# Altium schematic sheet BMS1.SchDoc
size A0
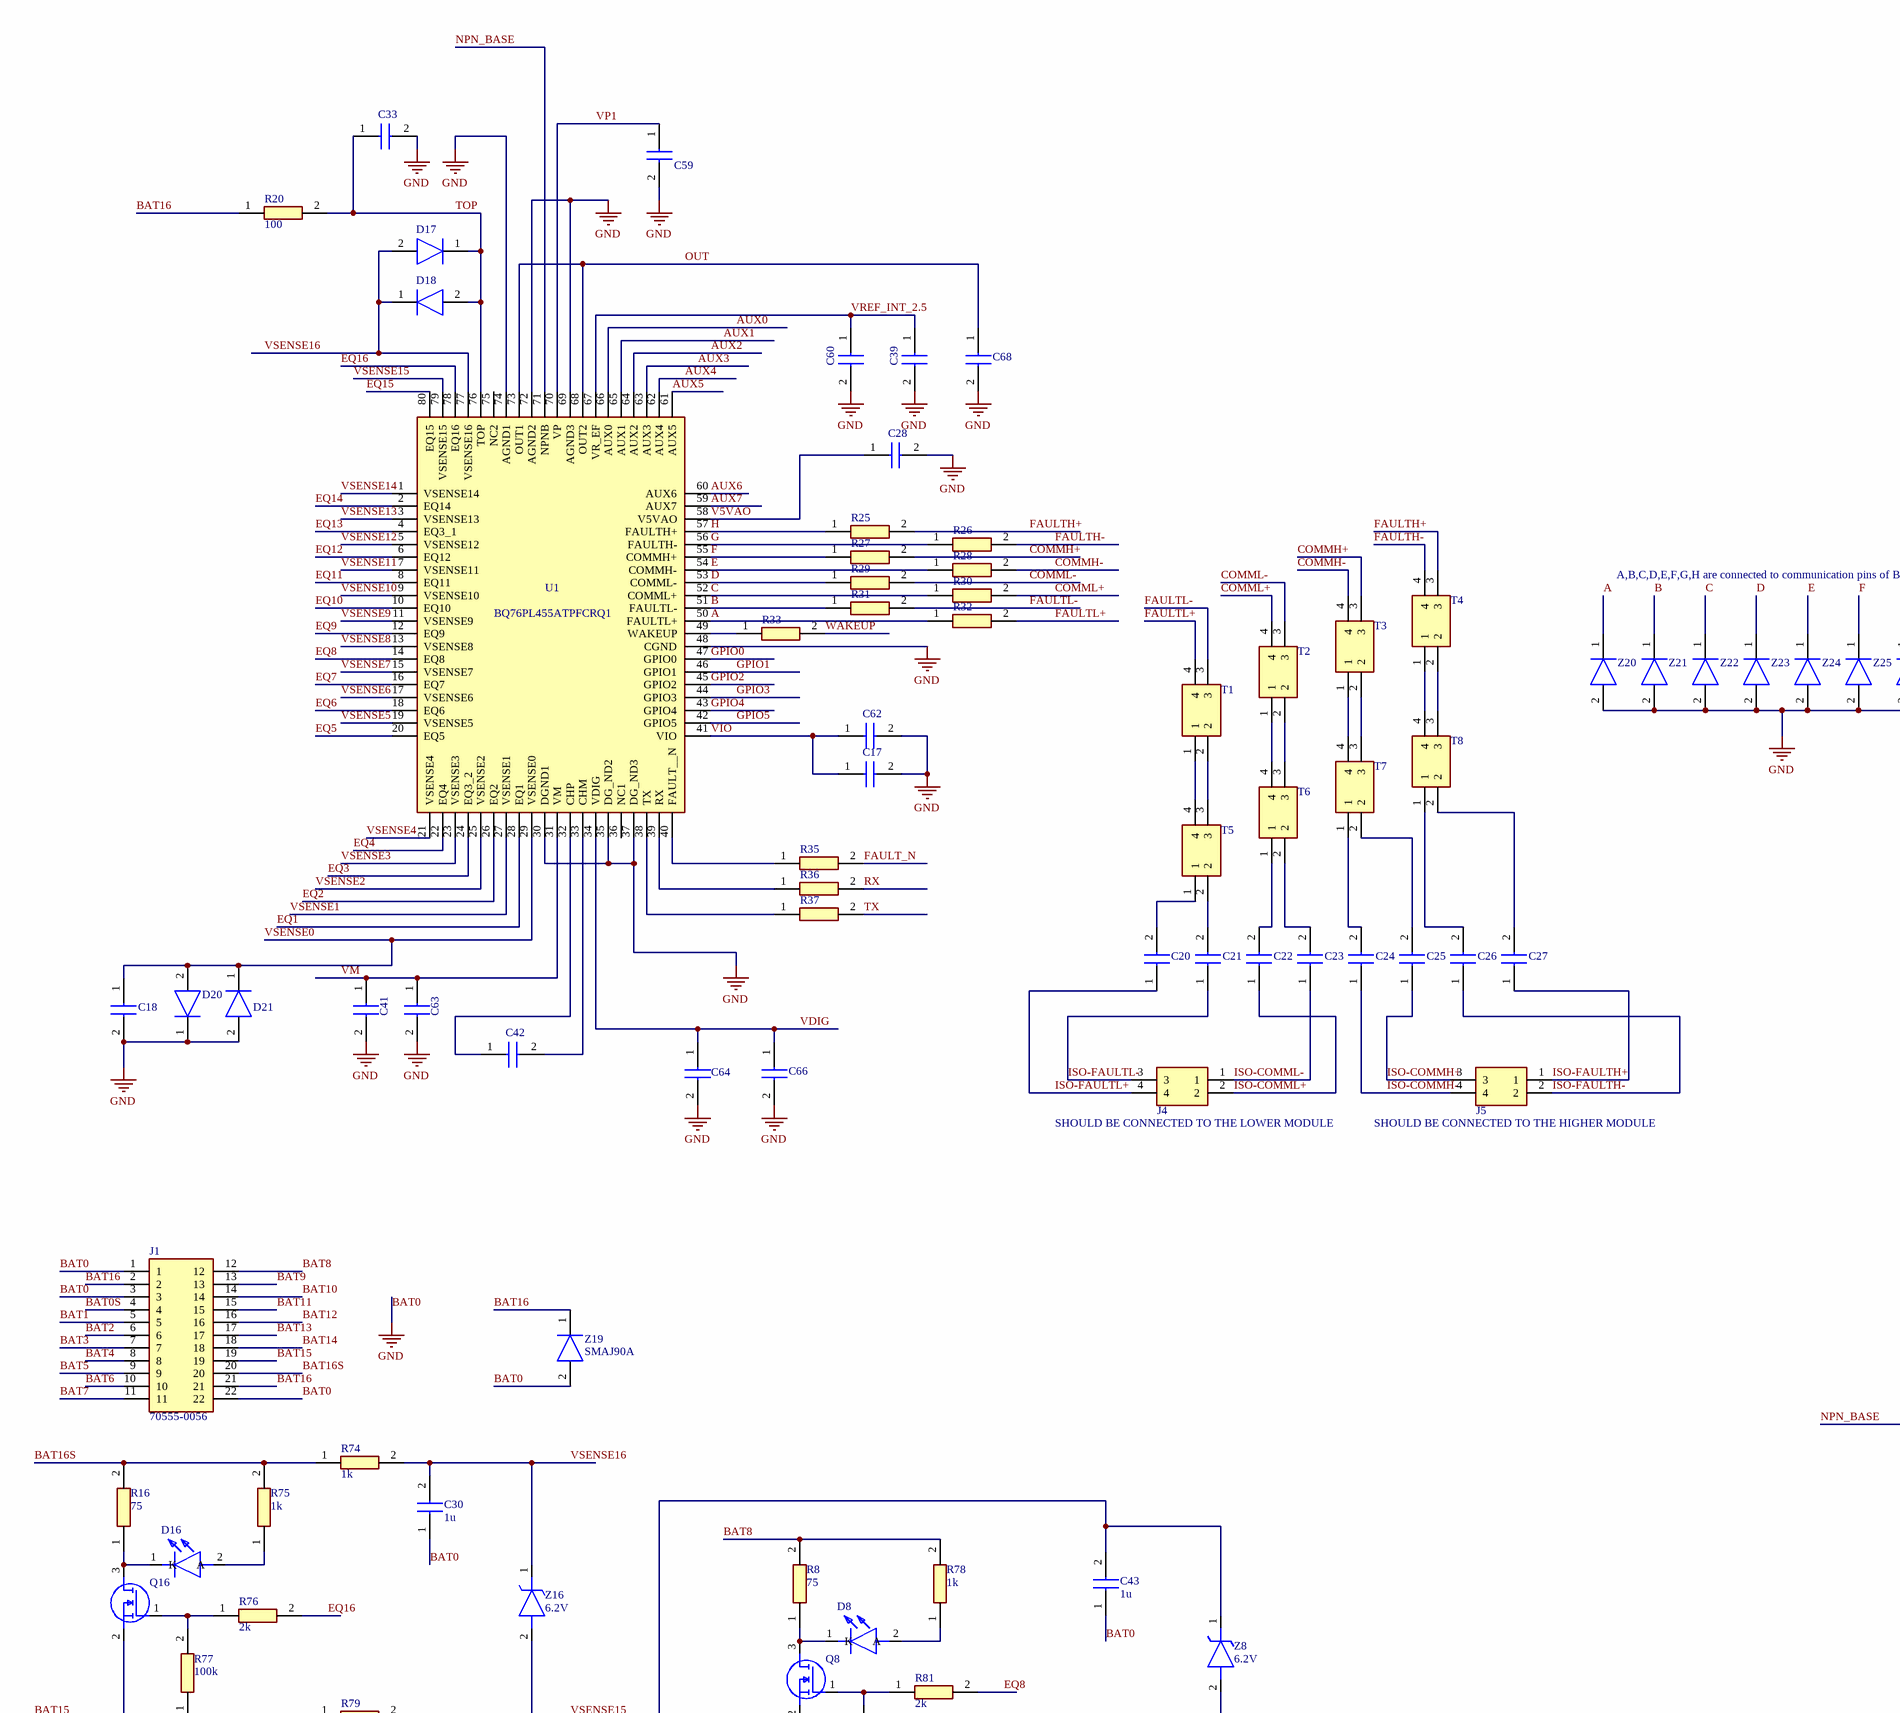
[diagram p0: BMS1.SchDoc, top left]
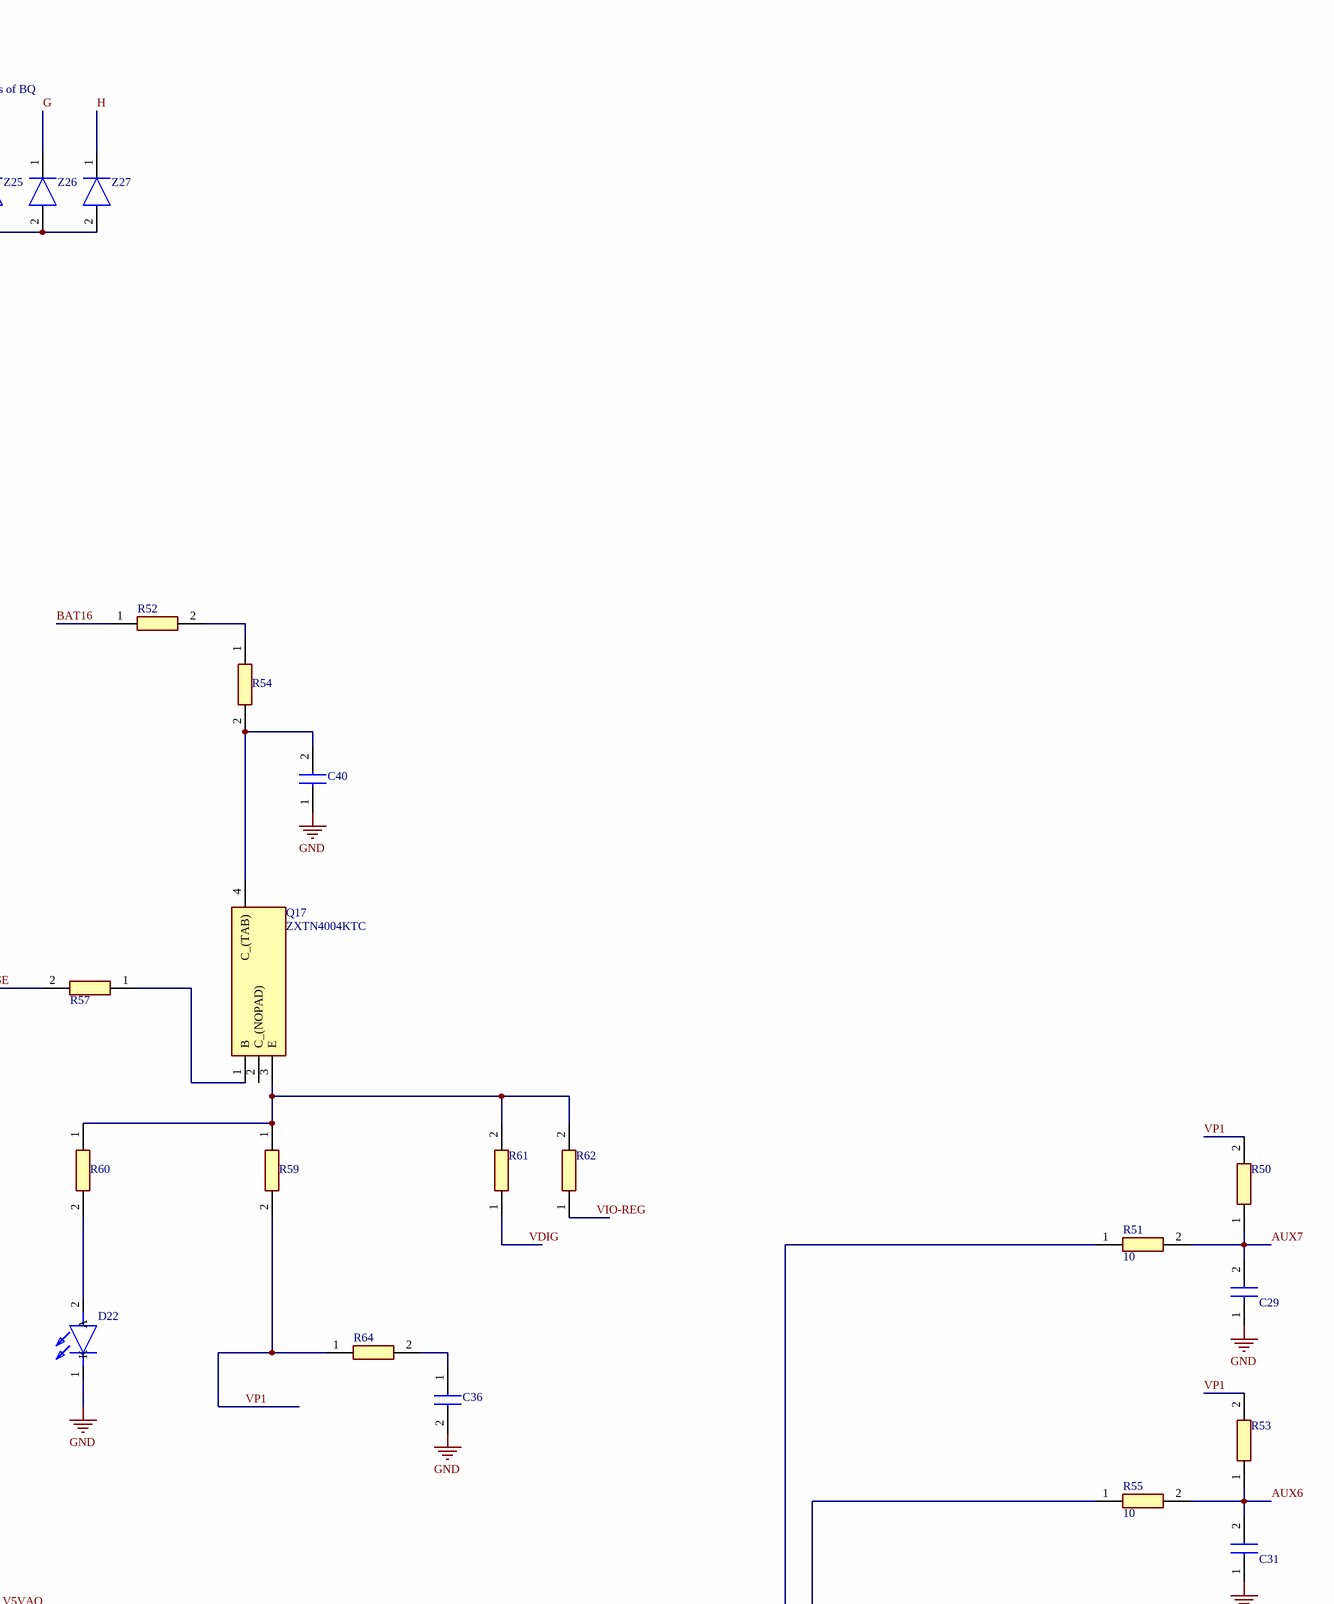
[diagram p1: BMS1.SchDoc, top right]
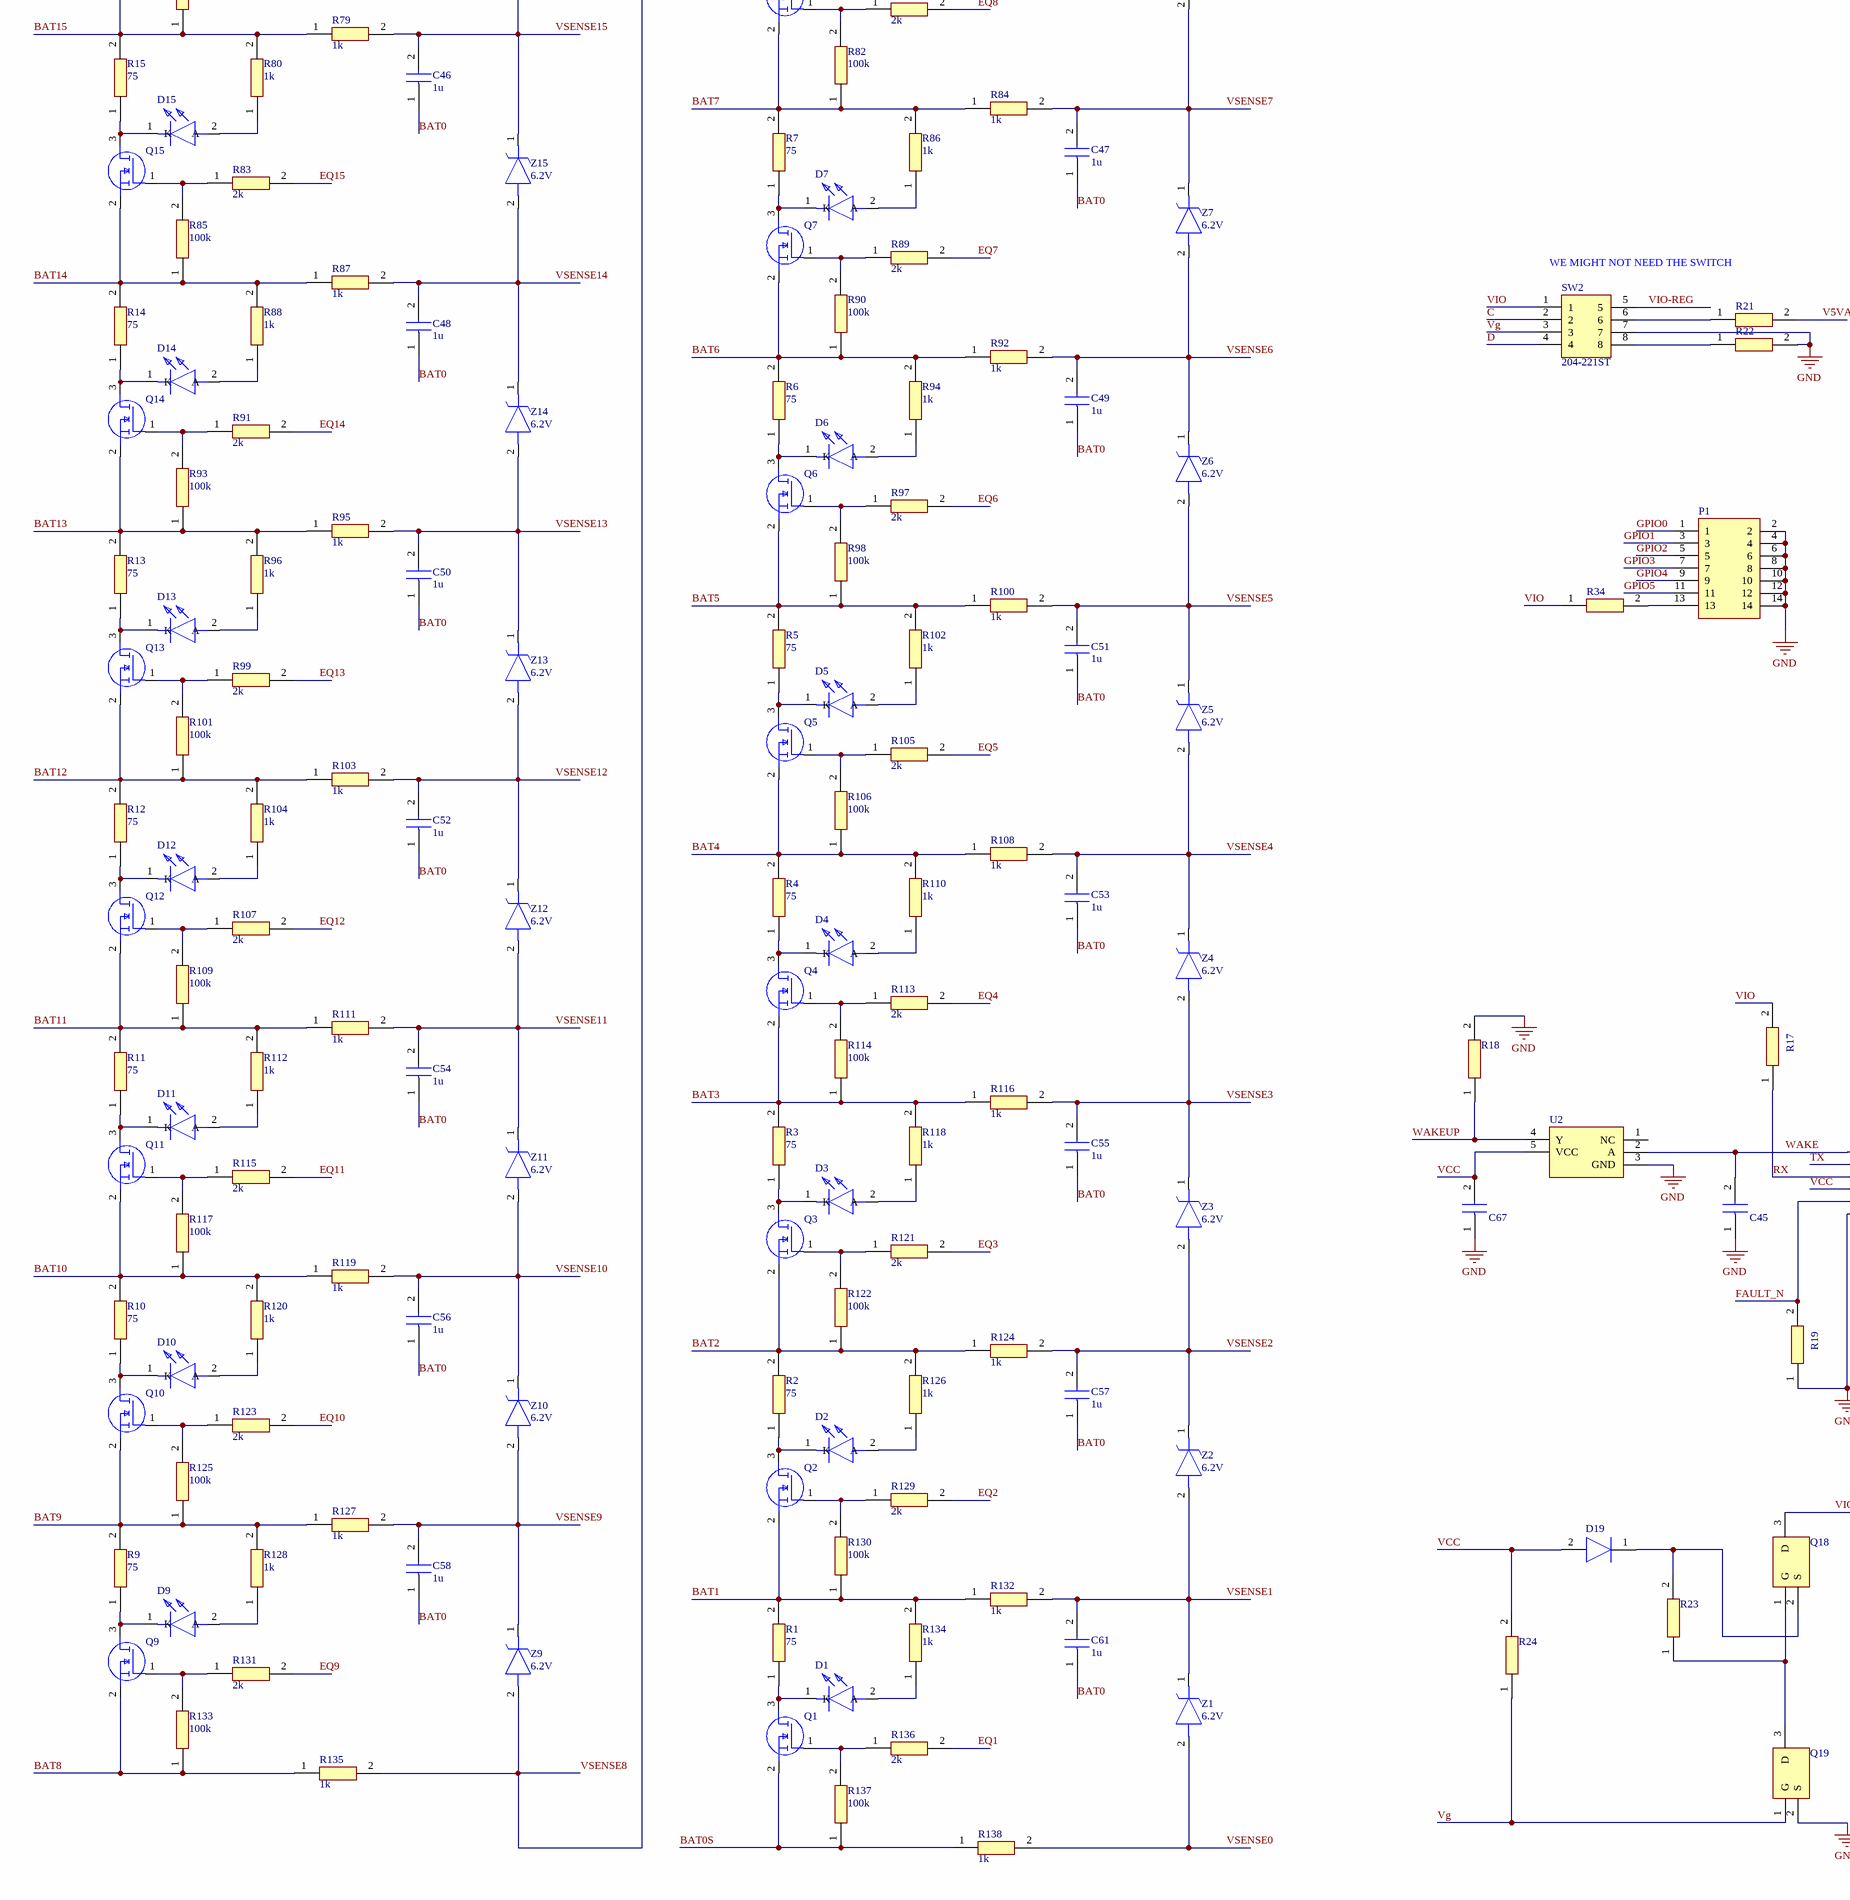
[diagram p2: BMS1.SchDoc, bottom left]
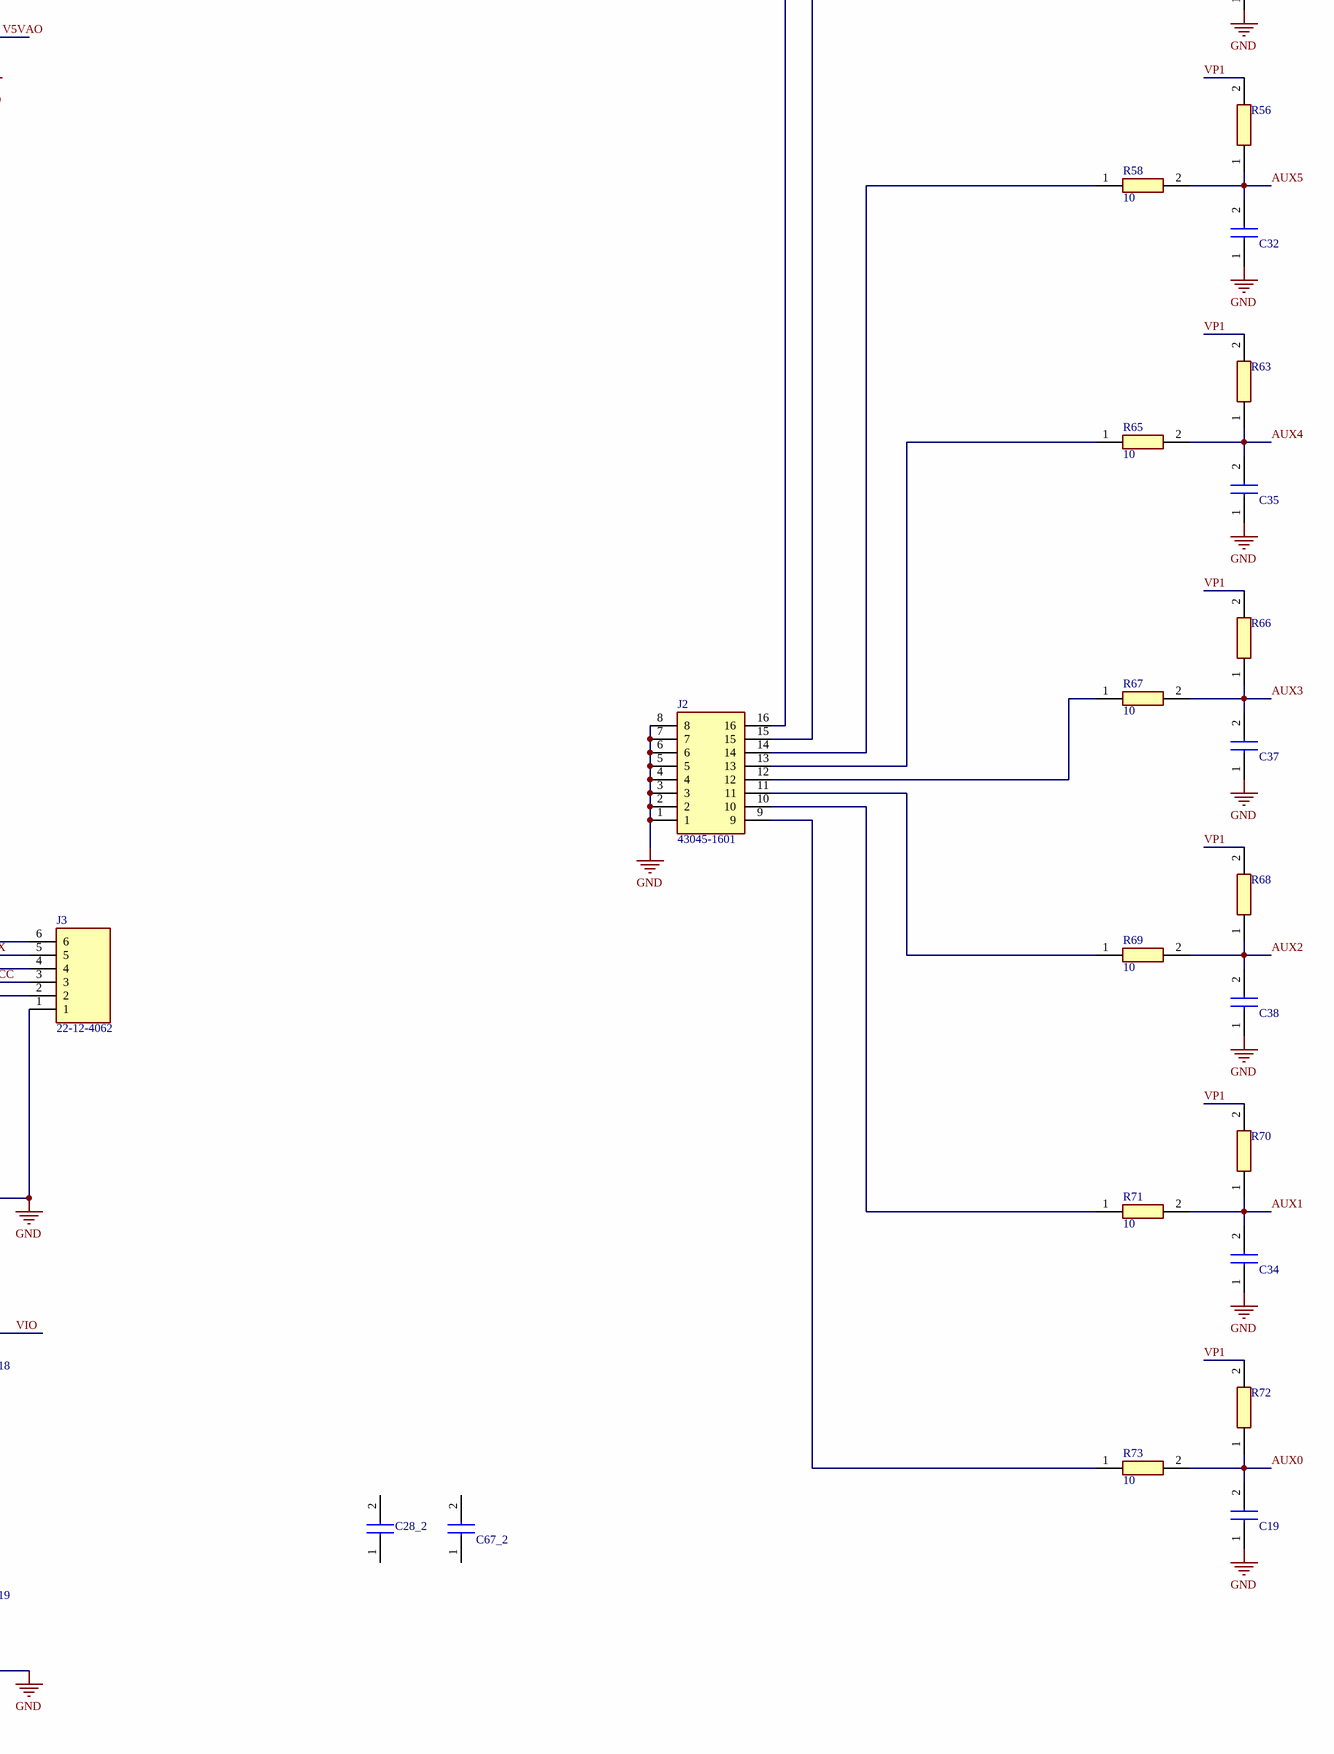
[diagram p3: BMS1.SchDoc, bottom right]

## Parts
C17  1u  [CAPC1608X80N]  (value not drawn)
C18  1u  [CAPC1608X80N]  (value not drawn)
C19  C1608X7R1H104K080AA  [CAPC1608X80N]  (value not drawn)
C20  CC1206KKX7RCBB102  [CAPC3216X70N]  (value not drawn)
C21  CC1206KKX7RCBB102  [CAPC3216X70N]  (value not drawn)
C22  CC1206KKX7RCBB102  [CAPC3216X70N]  (value not drawn)
C23  CC1206KKX7RCBB102  [CAPC3216X70N]  (value not drawn)
C24  CC1206KKX7RCBB102  [CAPC3216X70N]  (value not drawn)
C25  CC1206KKX7RCBB102  [CAPC3216X70N]  (value not drawn)
C26  CC1206KKX7RCBB102  [CAPC3216X70N]  (value not drawn)
C27  CC1206KKX7RCBB102  [CAPC3216X70N]  (value not drawn)
C28  4.7u  [CAPC2012X145N]  (value not drawn)
C28_2  0805YC475KAT2A  [CAPC2013X152N]  (value not drawn)
C29  C1608X7R1H104K080AA  [CAPC1608X80N]  (value not drawn)
C30  1u  [CAPC3225X180N]
C31  C1608X7R1H104K080AA  [CAPC1608X80N]  (value not drawn)
C32  C1608X7R1H104K080AA  [CAPC1608X80N]  (value not drawn)
C33  0.1u  [CAPC3225X150N]  (value not drawn)
C34  C1608X7R1H104K080AA  [CAPC1608X80N]  (value not drawn)
C35  C1608X7R1H104K080AA  [CAPC1608X80N]  (value not drawn)
C36  GRM31CR71H475KA12L  [CAPC3216X180N]  (value not drawn)
C37  C1608X7R1H104K080AA  [CAPC1608X80N]  (value not drawn)
C38  C1608X7R1H104K080AA  [CAPC1608X80N]  (value not drawn)
C39  0.1u  [CAPC1608X95N]  (value not drawn)
C40  GRM31CR72A105KA01L  [CAPC3216X180N]  (value not drawn)
C41  4.7u  [CAPC2012X145N]  (value not drawn)
C42  22n  [CAPC1608X80N]  (value not drawn)
C43  1u  [CAPC3225X180N]
C45  GRM188R71C104KA01D  [CAPC1608X90N]  (value not drawn)
C46  1u  [CAPC3225X180N]
C47  1u  [CAPC3225X180N]
C48  1u  [CAPC3225X180N]
C49  1u  [CAPC3225X180N]
C50  1u  [CAPC3225X180N]
C51  1u  [CAPC3225X180N]
C52  1u  [CAPC3225X180N]
C53  1u  [CAPC3225X180N]
C54  1u  [CAPC3225X180N]
C55  1u  [CAPC3225X180N]
C56  1u  [CAPC3225X180N]
C57  1u  [CAPC3225X180N]
C58  1u  [CAPC3225X180N]
C59  0.1u  [CAPC1608X95N]  (value not drawn)
C60  1.8u  [CAPC3225X170N]  (value not drawn)
C61  1u  [CAPC3225X180N]
C62  0.1u  [CAPC1608X95N]  (value not drawn)
C63  0.1u  [CAPC1608X95N]  (value not drawn)
C64  0.1u  [CAPC1608X95N]  (value not drawn)
C66  4.7u  [CAPC2012X145N]  (value not drawn)
C67  GRM188R71C104KA01D  [CAPC1608X90N]  (value not drawn)
C67_2  GRM188R72A104KA35D  [CAPC1608X90N]  (value not drawn)
C68  2700pF  [CAPC2012X147N]  (value not drawn)
D1  HSMG-C150  [LEDC3216X120N]  (value not drawn)
D2  HSMG-C150  [LEDC3216X120N]  (value not drawn)
D3  HSMG-C150  [LEDC3216X120N]  (value not drawn)
D4  HSMG-C150  [LEDC3216X120N]  (value not drawn)
D5  HSMG-C150  [LEDC3216X120N]  (value not drawn)
D6  HSMG-C150  [LEDC3216X120N]  (value not drawn)
D7  HSMG-C150  [LEDC3216X120N]  (value not drawn)
D8  HSMG-C150  [LEDC3216X120N]  (value not drawn)
D9  HSMG-C150  [LEDC3216X120N]  (value not drawn)
D10  HSMG-C150  [LEDC3216X120N]  (value not drawn)
D11  HSMG-C150  [LEDC3216X120N]  (value not drawn)
D12  HSMG-C150  [LEDC3216X120N]  (value not drawn)
D13  HSMG-C150  [LEDC3216X120N]  (value not drawn)
D14  HSMG-C150  [LEDC3216X120N]  (value not drawn)
D15  HSMG-C150  [LEDC3216X120N]  (value not drawn)
D16  HSMG-C150  [LEDC3216X120N]  (value not drawn)
D17  100v  [SOD3716X115N]  (value not drawn)
D18  100V  [SOD3716X115N]  (value not drawn)
D19  1N5819HW-7-F  [SOD3716X145N]  (value not drawn)
D20  100v  [SOD3716X115N]  (value not drawn)
D21  100v  [SOD3716X115N]  (value not drawn)
D22  HSMG-C150  [LEDC3216X120N]  (value not drawn)
J1  70555-0056  [70555-0056]
J2  43045-1601  [0430451600]
J3  22-12-4062  [22-12-4062]
J4  70551-0038  [70551-0038_1]  (value not drawn)
J5  70551-0038  [70551-0038_1]  (value not drawn)
P1  HTSW-107-07-G-D  [HDRV14W64P254_2X7_1778X503X673P]  (value not drawn)
Q1  2V7002KT1G  [SOT96P237X111-3N]  (value not drawn)
Q2  2V7002KT1G  [SOT96P237X111-3N]  (value not drawn)
Q3  2V7002KT1G  [SOT96P237X111-3N]  (value not drawn)
Q4  2V7002KT1G  [SOT96P237X111-3N]  (value not drawn)
Q5  2V7002KT1G  [SOT96P237X111-3N]  (value not drawn)
Q6  2V7002KT1G  [SOT96P237X111-3N]  (value not drawn)
Q7  2V7002KT1G  [SOT96P237X111-3N]  (value not drawn)
Q8  2V7002KT1G  [SOT96P237X111-3N]  (value not drawn)
Q9  2V7002KT1G  [SOT96P237X111-3N]  (value not drawn)
Q10  2V7002KT1G  [SOT96P237X111-3N]  (value not drawn)
Q11  2V7002KT1G  [SOT96P237X111-3N]  (value not drawn)
Q12  2V7002KT1G  [SOT96P237X111-3N]  (value not drawn)
Q13  2V7002KT1G  [SOT96P237X111-3N]  (value not drawn)
Q14  2V7002KT1G  [SOT96P237X111-3N]  (value not drawn)
Q15  2V7002KT1G  [SOT96P237X111-3N]  (value not drawn)
Q16  2V7002KT1G  [SOT96P237X111-3N]  (value not drawn)
Q17  ZXTN4004KTC  [TO229P990X239-4N]
Q18  SI2319DS-T1-E3  [SOT95P237X112-3N]  (value not drawn)
Q19  2N7002E-T1-E3  [SOT95P237X112-3N]  (value not drawn)
R1  75  [RESC6332X70N]
R2  75  [RESC6332X70N]
R3  75  [RESC6332X70N]
R4  75  [RESC6332X70N]
R5  75  [RESC6332X70N]
R6  75  [RESC6332X70N]
R7  75  [RESC6332X70N]
R8  75  [RESC6332X70N]
R9  75  [RESC6332X70N]
R10  75  [RESC6332X70N]
R11  75  [RESC6332X70N]
R12  75  [RESC6332X70N]
R13  75  [RESC6332X70N]
R14  75  [RESC6332X70N]
R15  75  [RESC6332X70N]
R16  75  [RESC6332X70N]
R17  CRCW060310K0FKEA  [RESC1608X50N]  (value not drawn)
R18  RC0603FR-07100KL  [RESC1608X55N]  (value not drawn)
R19  RC0603FR-0749K9L  [RESC1608X55N]  (value not drawn)
R20  100  [RESC3216X60N]
R21  RC0603FR-07100KL  [RESC1608X55N]  (value not drawn)
R22  RC0603FR-07100KL  [RESC1608X55N]  (value not drawn)
R23  RC0603FR-07100KL  [RESC1608X55N]  (value not drawn)
R24  RC0603FR-07100KL  [RESC1608X55N]  (value not drawn)
R25  10  [RESC3216X60N]  (value not drawn)
R26  10  [RESC3216X60N]  (value not drawn)
R27  10  [RESC3216X60N]  (value not drawn)
R28  10  [RESC3216X60N]  (value not drawn)
R29  10  [RESC3216X60N]  (value not drawn)
R30  10  [RESC3216X60N]  (value not drawn)
R31  10  [RESC3216X60N]  (value not drawn)
R32  10  [RESC3216X60N]  (value not drawn)
R33  49.9  [RESC1608X50N]  (value not drawn)
R34  CRCW0603100RFKEA  [RESC1608X50N]  (value not drawn)
R35  49.9  [RESC1608X50N]  (value not drawn)
R36  49.9  [RESC1608X50N]  (value not drawn)
R37  49.9  [RESC1608X50N]  (value not drawn)
R50  CRCW060310K0FKEA  [RESC1608X50N]  (value not drawn)
R51  10  [RESC1608X50N]
R52  CRCW2512200RJNEG  [RESC6332X70N]  (value not drawn)
R53  CRCW060310K0FKEA  [RESC1608X50N]  (value not drawn)
R54  CRCW2512200RJNEG  [RESC6332X70N]  (value not drawn)
R55  10  [RESC1608X50N]
R56  CRCW060310K0FKEA  [RESC1608X50N]  (value not drawn)
R57  CRCW06030000Z0EA  [RESC1608X50N]  (value not drawn)
R58  10  [RESC1608X50N]
R59  CRCW06030000Z0EA  [RESC1608X50N]  (value not drawn)
R60  CRCW06032K00FKEA  [RESC1608X50N]  (value not drawn)
R61  RC0603FR-071RL  [RESC1608X55N]  (value not drawn)
R62  RC0603FR-071RL  [RESC1608X55N]  (value not drawn)
R63  CRCW060310K0FKEA  [RESC1608X50N]  (value not drawn)
R64  ERJ-3RQFR39V  [RESC1608X60N]  (value not drawn)
R65  10  [RESC1608X50N]
R66  CRCW060310K0FKEA  [RESC1608X50N]  (value not drawn)
R67  10  [RESC1608X50N]
R68  CRCW060310K0FKEA  [RESC1608X50N]  (value not drawn)
R69  10  [RESC1608X50N]
R70  CRCW060310K0FKEA  [RESC1608X50N]  (value not drawn)
R71  10  [RESC1608X50N]
R72  CRCW060310K0FKEA  [RESC1608X50N]  (value not drawn)
R73  10  [RESC1608X50N]
R74  1k  [RESC1608X50N]
R75  1k  [RESC1608X50N]
R76  2k  [RESC1608X50N]
R77  100k  [RESC1608X55N]
R78  1k  [RESC1608X50N]
R79  1k  [RESC1608X50N]
R80  1k  [RESC1608X50N]
R81  2k  [RESC1608X50N]
R82  100k  [RESC1608X55N]
R83  2k  [RESC1608X50N]
R84  1k  [RESC1608X50N]
R85  100k  [RESC1608X55N]
R86  1k  [RESC1608X50N]
R87  1k  [RESC1608X50N]
R88  1k  [RESC1608X50N]
R89  2k  [RESC1608X50N]
R90  100k  [RESC1608X55N]
R91  2k  [RESC1608X50N]
R92  1k  [RESC1608X50N]
R93  100k  [RESC1608X55N]
R94  1k  [RESC1608X50N]
R95  1k  [RESC1608X50N]
R96  1k  [RESC1608X50N]
R97  2k  [RESC1608X50N]
R98  100k  [RESC1608X55N]
R99  2k  [RESC1608X50N]
R100  1k  [RESC1608X50N]
R101  100k  [RESC1608X55N]
R102  1k  [RESC1608X50N]
R103  1k  [RESC1608X50N]
R104  1k  [RESC1608X50N]
R105  2k  [RESC1608X50N]
R106  100k  [RESC1608X55N]
R107  2k  [RESC1608X50N]
R108  1k  [RESC1608X50N]
R109  100k  [RESC1608X55N]
R110  1k  [RESC1608X50N]
R111  1k  [RESC1608X50N]
R112  1k  [RESC1608X50N]
R113  2k  [RESC1608X50N]
R114  100k  [RESC1608X55N]
R115  2k  [RESC1608X50N]
R116  1k  [RESC1608X50N]
R117  100k  [RESC1608X55N]
R118  1k  [RESC1608X50N]
R119  1k  [RESC1608X50N]
R120  1k  [RESC1608X50N]
R121  2k  [RESC1608X50N]
R122  100k  [RESC1608X55N]
R123  2k  [RESC1608X50N]
R124  1k  [RESC1608X50N]
R125  100k  [RESC1608X55N]
R126  1k  [RESC1608X50N]
R127  1k  [RESC1608X50N]
R128  1k  [RESC1608X50N]
R129  2k  [RESC1608X50N]
R130  100k  [RESC1608X55N]
R131  2k  [RESC1608X50N]
R132  1k  [RESC1608X50N]
R133  100k  [RESC1608X55N]
R134  1k  [RESC1608X50N]
R135  1k  [RESC1608X50N]
R136  2k  [RESC1608X50N]
R137  100k  [RESC1608X55N]
R138  1k  [RESC1608X50N]
SW2  204-221ST  [204-221ST]
T1  744242471  [744242471]  (value not drawn)
T2  744242471  [744242471]  (value not drawn)
T3  744242471  [744242471]  (value not drawn)
T4  744242471  [744242471]  (value not drawn)
T5  ACT45B-101-2P-TL003  [TDK_ACT45B_2]  (value not drawn)
T6  ACT45B-101-2P-TL003  [TDK_ACT45B_2]  (value not drawn)
T7  ACT45B-101-2P-TL003  [TDK_ACT45B_2]  (value not drawn)
T8  ACT45B-101-2P-TL003  [TDK_ACT45B_2]  (value not drawn)
U1  BQ76PL455ATPFCRQ1  [QFP50P1400X1400X120-80N]
U2  NC7SZ04M5X  [SOT95P280X145-5N]  (value not drawn)
Z1  6.2V  [SOD3716X145N]
Z2  6.2V  [SOD3716X145N]
Z3  6.2V  [SOD3716X145N]
Z4  6.2V  [SOD3716X145N]
Z5  6.2V  [SOD3716X145N]
Z6  6.2V  [SOD3716X145N]
Z7  6.2V  [SOD3716X145N]
Z8  6.2V  [SOD3716X145N]
Z9  6.2V  [SOD3716X145N]
Z10  6.2V  [SOD3716X145N]
Z11  6.2V  [SOD3716X145N]
Z12  6.2V  [SOD3716X145N]
Z13  6.2V  [SOD3716X145N]
Z14  6.2V  [SOD3716X145N]
Z15  6.2V  [SOD3716X145N]
Z16  6.2V  [SOD3716X145N]
Z19  SMAJ90A  [DIOM5026X229N]
Z20  PESD5V0U1UA,115  [SOD2512X110N]  (value not drawn)
Z21  PESD5V0U1UA,115  [SOD2512X110N]  (value not drawn)
Z22  PESD5V0U1UA,115  [SOD2512X110N]  (value not drawn)
Z23  PESD5V0U1UA,115  [SOD2512X110N]  (value not drawn)
Z24  PESD5V0U1UA,115  [SOD2512X110N]  (value not drawn)
Z25  PESD5V0U1UA,115  [SOD2512X110N]  (value not drawn)
Z26  PESD5V0U1UA,115  [SOD2512X110N]  (value not drawn)
Z27  PESD5V0U1UA,115  [SOD2512X110N]  (value not drawn)

## Nets
BAT0: C17.2 C18.2 C19.1 C28.2 C29.1 C30.1 C31.1 C32.1 C33.2 C34.1 C35.1 C36.2 C37.1 C38.1 C39.2 C40.1 C41.2 C43.1 C45.1 C46.1 C47.1 C48.1 C49.1 C50.1 C51.1 C52.1 C53.1 C54.1 C55.1 C56.1 C57.1 C58.1 C59.2 C60.2 C61.1 C62.2 C63.2 C64.2 C66.2 C67.1 C68.2 D20.1(K) D21.2(A) D22.1(K) J1.1 J1.3 J1.22 J2.1 J2.2 J2.3 J2.4 J2.5 J2.6 J2.7 J2.8 J3.1 P1.2 P1.4 P1.6 P1.8 P1.10 P1.12 P1.14 Q19.2(S) R18.2 R19.1 R22.2 SW2.7 U1.30(DGND1) U1.35(DG_ND2) U1.37(DG_ND3) U1.48(CGND) U1.69(AGND3) U1.72(AGND2) U1.74(AGND1) U2.3(GND) Z19.2(A) Z20.2(A) Z21.2(A) Z22.2(A) Z23.2(A) Z24.2(A) Z25.2(A) Z26.2(A) Z27.2(A)  [also labelled GND]
A: R32.1 U1.50(FAULTL+) Z20.1(K)
AUX0: C19.2 R72.1 R73.2 U1.66(AUX0)
AUX1: C34.2 R70.1 R71.2 U1.65(AUX1)
AUX2: C38.2 R68.1 R69.2 U1.64(AUX2)
AUX3: C37.2 R66.1 R67.2 U1.63(AUX3)
AUX4: C35.2 R63.1 R65.2 U1.62(AUX4)
AUX5: C32.2 R56.1 R58.2 U1.61(AUX5)
AUX6: C31.2 R53.1 R55.2 U1.60(AUX6)
AUX7: C29.2 R50.1 R51.2 U1.59(AUX7)
B: R31.1 U1.51(FAULTL-) Z21.1(K)
BAT0S: J1.4 Q1.2(S) R137.1 R138.1
BAT1: J1.5 Q2.2(S) R1.2 R130.1 R132.1 R134.2
BAT2: J1.6 Q3.2(S) R2.2 R122.1 R124.1 R126.2
BAT3: J1.7 Q4.2(S) R3.2 R114.1 R116.1 R118.2
BAT4: J1.8 Q5.2(S) R4.2 R106.1 R108.1 R110.2
BAT5: J1.9 Q6.2(S) R5.2 R98.1 R100.1 R102.2
BAT6: J1.10 Q7.2(S) R6.2 R90.1 R92.1 R94.2
BAT7: J1.11 Q8.2(S) R7.2 R82.1 R84.1 R86.2
BAT8: J1.12 Q9.2(S) R8.2 R78.2 R133.1 R135.1
BAT9: J1.13 Q10.2(S) R9.2 R125.1 R127.1 R128.2
BAT10: J1.14 Q11.2(S) R10.2 R117.1 R119.1 R120.2
BAT11: J1.15 Q12.2(S) R11.2 R109.1 R111.1 R112.2
BAT12: J1.16 Q13.2(S) R12.2 R101.1 R103.1 R104.2
BAT13: J1.17 Q14.2(S) R13.2 R93.1 R95.1 R96.2
BAT14: J1.18 Q15.2(S) R14.2 R85.1 R87.1 R88.2
BAT15: J1.19 Q16.2(S) R15.2 R77.1 R79.1 R80.2
BAT16: J1.2 J1.21 R20.1 R52.1 Z19.1(K)
BAT16S: J1.20 R16.2 R74.1 R75.2
C: R30.1 SW2.2 U1.52(COMML+) Z22.1(K)
COMMH+: R27.2 T3.3
COMMH-: R28.2 T3.4
COMML+: R30.2 T2.4
COMML-: R29.2 T2.3
D: R29.1 SW2.4 U1.53(COMML-) Z23.1(K)
E: R28.1 U1.54(COMMH-) Z24.1(K)
EQ1: R136.2 U1.28(EQ1)
EQ2: R129.2 U1.26(EQ2)
EQ3: R121.2 U1.24(EQ3_2)
EQ4: R113.2 U1.22(EQ4)
EQ5: R105.2 U1.20(EQ5)
EQ6: R97.2 U1.18(EQ6)
EQ7: R89.2 U1.16(EQ7)
EQ8: R81.2 U1.14(EQ8)
EQ9: R131.2 U1.12(EQ9)
EQ10: R123.2 U1.10(EQ10)
EQ11: R115.2 U1.8(EQ11)
EQ12: R107.2 U1.6(EQ12)
EQ13: R99.2 U1.4(EQ3_1)
EQ14: R91.2 U1.2(EQ14)
EQ15: R83.2 U1.80(EQ15)
EQ16: R76.2 U1.78(EQ16)
F: R27.1 U1.55(COMMH+) Z25.1(K)
FAULT_N: J3.2 R19.2 R35.2
FAULTH+: R25.2 T4.3
FAULTH-: R26.2 T4.4
FAULTL+: R32.2 T1.4
FAULTL-: R31.2 T1.3
G: R26.1 U1.56(FAULTH-) Z26.1(K)
GPIO0: P1.1 U1.47(GPIO0)
GPIO1: P1.3 U1.46(GPIO1)
GPIO2: P1.5 U1.45(GPIO2)
GPIO3: P1.7 U1.44(GPIO3)
GPIO4: P1.9 U1.43(GPIO4)
GPIO5: P1.11 U1.42(GPIO5)
H: R25.1 U1.57(FAULTH+) Z27.1(K)
ISO-COMMH+: C25.1 J5.3
ISO-COMMH-: C24.1 J5.4
ISO-COMML+: C22.1 J4.2
ISO-COMML-: C23.1 J4.1
ISO-FAULTH+: C27.1 J5.1
ISO-FAULTH-: C26.1 J5.2
ISO-FAULTL+: C20.1 J4.4
ISO-FAULTL-: C21.1 J4.3
NPN_BASE: R57.2 U1.71(NPNB)
OUT: C68.1 U1.68(OUT2) U1.73(OUT1)
RX: J3.4 R17.1 R36.2
TOP: C33.1 D17.1(K) D18.2(A) R20.2 U1.76(TOP)
TX: J3.5 R37.2
V5VAO: C28.1 R21.2 U1.58(V5VAO)
VCC: C67.2 D19.2(A) J3.3 R24.2 U2.5(VCC)
VDIG: C64.1 C66.1 R61.1 U1.34(VDIG)
Vg: Q19.1(G) R24.1 SW2.3
VIO: C17.1 C62.1 Q18.3(D) R17.2 R34.1 SW2.1 U1.41(VIO)
VIO-REG: R62.1 SW2.5
VM: C41.1 C63.1 U1.31(VM)
VP1: C59.1 R50.2 R53.2 R56.2 R59.2 R63.2 R64.1(R1) R66.2 R68.2 R70.2 R72.2 U1.70(VP)
VREF_INT_2.5: C39.1 C60.1 U1.67(VR_EF)
VSENSE0: C18.1 D20.2(A) D21.1(K) R138.2 U1.29(VSENSE0) Z1.2(A)
VSENSE1: C61.2 R132.2 U1.27(VSENSE1) Z1.1(K) Z2.2(A)
VSENSE2: C57.2 R124.2 U1.25(VSENSE2) Z2.1(K) Z3.2(A)
VSENSE3: C55.2 R116.2 U1.23(VSENSE3) Z3.1(K) Z4.2(A)
VSENSE4: C53.2 R108.2 U1.21(VSENSE4) Z4.1(K) Z5.2(A)
VSENSE5: C51.2 R100.2 U1.19(VSENSE5) Z5.1(K) Z6.2(A)
VSENSE6: C49.2 R92.2 U1.17(VSENSE6) Z6.1(K) Z7.2(A)
VSENSE7: C47.2 R84.2 U1.15(VSENSE7) Z7.1(K) Z8.2(A)
VSENSE8: C43.2 R135.2 U1.13(VSENSE8) Z8.1(K) Z9.2(A)
VSENSE9: C58.2 R127.2 U1.11(VSENSE9) Z9.1(K) Z10.2(A)
VSENSE10: C56.2 R119.2 U1.9(VSENSE10) Z10.1(K) Z11.2(A)
VSENSE11: C54.2 R111.2 U1.7(VSENSE11) Z11.1(K) Z12.2(A)
VSENSE12: C52.2 R103.2 U1.5(VSENSE12) Z12.1(K) Z13.2(A)
VSENSE13: C50.2 R95.2 U1.3(VSENSE13) Z13.1(K) Z14.2(A)
VSENSE14: C48.2 R87.2 U1.1(VSENSE14) Z14.1(K) Z15.2(A)
VSENSE15: C46.2 R79.2 U1.79(VSENSE15) Z15.1(K) Z16.2(A)
VSENSE16: C30.2 D17.2(A) D18.1(K) R74.2 U1.77(VSENSE16) Z16.1(K)
WAKE: C45.2 J3.6 U2.2(A)
WAKEUP: R18.1 R33.2 U2.4(Y)
NetC20_2: C20.2 T5.1
NetC21_2: C21.2 T5.2
NetC22_2: C22.2 T6.1
NetC23_2: C23.2 T6.2
NetC24_2: C24.2 T7.1
NetC25_2: C25.2 T7.2
NetC26_2: C26.2 T8.1
NetC27_2: C27.2 T8.2
NetC36_1: C36.1 R64.2(R2)
NetC40_2: C40.2 Q17.4(C_(TAB)) R54.2
NetC42_1: C42.1 U1.32(CHP)
NetC42_2: C42.2 U1.33(CHM)
NetD1_1: D1.1(K) Q1.3(D) R1.1
NetD1_2: D1.2(A) R134.1
NetD2_1: D2.1(K) Q2.3(D) R2.1
NetD2_2: D2.2(A) R126.1
NetD3_1: D3.1(K) Q3.3(D) R3.1
NetD3_2: D3.2(A) R118.1
NetD4_1: D4.1(K) Q4.3(D) R4.1
NetD4_2: D4.2(A) R110.1
NetD5_1: D5.1(K) Q5.3(D) R5.1
NetD5_2: D5.2(A) R102.1
NetD6_1: D6.1(K) Q6.3(D) R6.1
NetD6_2: D6.2(A) R94.1
NetD7_1: D7.1(K) Q7.3(D) R7.1
NetD7_2: D7.2(A) R86.1
NetD8_1: D8.1(K) Q8.3(D) R8.1
NetD8_2: D8.2(A) R78.1
NetD9_1: D9.1(K) Q9.3(D) R9.1
NetD9_2: D9.2(A) R128.1
NetD10_1: D10.1(K) Q10.3(D) R10.1
NetD10_2: D10.2(A) R120.1
NetD11_1: D11.1(K) Q11.3(D) R11.1
NetD11_2: D11.2(A) R112.1
NetD12_1: D12.1(K) Q12.3(D) R12.1
NetD12_2: D12.2(A) R104.1
NetD13_1: D13.1(K) Q13.3(D) R13.1
NetD13_2: D13.2(A) R96.1
NetD14_1: D14.1(K) Q14.3(D) R14.1
NetD14_2: D14.2(A) R88.1
NetD15_1: D15.1(K) Q15.3(D) R15.1
NetD15_2: D15.2(A) R80.1
NetD16_1: D16.1(K) Q16.3(D) R16.1
NetD16_2: D16.2(A) R75.1
NetD19_1: D19.1(K) Q18.2(S) R23.2
NetD22_2: D22.2(A) R60.2
NetJ2_9: J2.9 R73.1
NetJ2_10: J2.10 R71.1
NetJ2_11: J2.11 R69.1
NetJ2_12: J2.12 R67.1
NetJ2_13: J2.13 R65.1
NetJ2_14: J2.14 R58.1
NetJ2_15: J2.15 R55.1
NetJ2_16: J2.16 R51.1
NetP1_13: P1.13 R34.2
NetQ1_1: Q1.1(G) R136.1 R137.2
NetQ2_1: Q2.1(G) R129.1 R130.2
NetQ3_1: Q3.1(G) R121.1 R122.2
NetQ4_1: Q4.1(G) R113.1 R114.2
NetQ5_1: Q5.1(G) R105.1 R106.2
NetQ6_1: Q6.1(G) R97.1 R98.2
NetQ7_1: Q7.1(G) R89.1 R90.2
NetQ8_1: Q8.1(G) R81.1 R82.2
NetQ9_1: Q9.1(G) R131.1 R133.2
NetQ10_1: Q10.1(G) R123.1 R125.2
NetQ11_1: Q11.1(G) R115.1 R117.2
NetQ12_1: Q12.1(G) R107.1 R109.2
NetQ13_1: Q13.1(G) R99.1 R101.2
NetQ14_1: Q14.1(G) R91.1 R93.2
NetQ15_1: Q15.1(G) R83.1 R85.2
NetQ16_1: Q16.1(G) R76.1 R77.2
NetQ17_1: Q17.1(B) R57.1
NetQ17_3: Q17.3(E) R59.1 R60.1 R61.2 R62.2
NetQ18_1: Q18.1(G) Q19.3(D) R23.1
NetR21_1: R21.1 SW2.6
NetR22_1: R22.1 SW2.8
NetR33_1: R33.1 U1.49(WAKEUP)
NetR35_1: R35.1 U1.40(FAULT__N)
NetR36_1: R36.1 U1.39(RX)
NetR37_1: R37.1 U1.38(TX)
NetR52_2: R52.2 R54.1
NetT1_1: T1.1 T5.4
NetT1_2: T1.2 T5.3
NetT2_1: T2.1 T6.4
NetT2_2: T2.2 T6.3
NetT3_1: T3.1 T7.4
NetT3_2: T3.2 T7.3
NetT4_1: T4.1 T8.4
NetT4_2: T4.2 T8.3

Not connected (* = marked no-connect by the designer): C28_2 1(C1) 2(C2); C67_2 1 2; Q17 2(C_(NOPAD)); U1 36(NC1) 75(NC2); U2 1(NC)

## Notes on the sheet
- A,B,C,D,E,F,G,H are connected to communication pins of BQ
- (near J4) SHOULD BE CONNECTED TO THE LOWER MODULE
- (near J5) SHOULD BE CONNECTED TO THE HIGHER MODULE
- WE MIGHT NOT NEED THE SWITCH

## Library data of the parts
C17 C18 = C1608X7R1C105K080AC: Capacitor; Manufacturer_Name: TDK; Datasheet Link: https://product.tdk.com/info/en/catalog/datasheets/mlcc_commercial_midvoltage_en.pdf; Height: 0.8mm; Manufacturer_Part_Number: C1608X7R1C105K080AC; Mouser Part Number: 810-C1608X7R1C105K; Mouser Price/Stock: https://www.mouser.com/Search/Refine.aspx?Keyword=810-C1608X7R1C105K; RS Part Number: 7414447P; RS Price/Stock: http://uk.rs-online.com/web/p/products/7414447P
C19 C29 C31 C32 C34 C35 C37 C38 = C1608X7R1H104K080AA: Capacitor; Manufacturer_Name: TDK; Datasheet Link: https://product.tdk.com/info/en/catalog/datasheets/mlcc_commercial_midvoltage_en.pdf; Height: 0.8mm; Manufacturer_Part_Number: C1608X7R1H104K080AA; Mouser Part Number: 810-C1608X7R1H104K; Mouser Price/Stock: https://www.mouser.com/Search/Refine.aspx?Keyword=810-C1608X7R1H104K; RS Part Number: 7414459P; RS Price/Stock: http://uk.rs-online.com/web/p/products/7414459P
C20-C27 = CC1206KKX7RCBB102: Capacitor; Manufacturer_Name: YAGEO (PHYCOMP); Datasheet Link: http://www.mouser.com/ds/2/447/Yageo_UPY-GP_NP0_16V-to-50V_9-358835.pdf; Height: 0.7mm; Manufacturer_Part_Number: CC1206KKX7RCBB102; Mouser Part Number: 603-CC126KKX7RCBB102; Mouser Price/Stock: https://www.mouser.com/Search/Refine.aspx?Keyword=603-CC126KKX7RCBB102
C28 C41 C66 = GRM21BR71C475KA73L: Capacitor; Manufacturer_Name: Murata Electronics; Datasheet Link: http://www.murata.com/~/media/webrenewal/support/library/catalog/products/capacitor/mlcc/c02e.pdf; Height: 1.45mm; Manufacturer_Part_Number: GRM21BR71C475KA73L; Mouser Part Number: 81-GRM21BR71C475KA73; Mouser Price/Stock: https://www.mouser.com/Search/Refine.aspx?Keyword=81-GRM21BR71C475KA73; RS Part Number: 7236085P; RS Price/Stock: http://uk.rs-online.com/web/p/products/7236085P
C28_2 = 0805YC475KAT2A: Capacitor; Manufacturer_Name: AVX; Allied_Number: 70474521; Manufacturer_Part_Number: 0805YC475KAT2A; Mouser Part Number: 581-0805YC475KAT2A; Mouser Price/Stock: https://www.mouser.com/Search/Refine.aspx?Keyword=581-0805YC475KAT2A; RS Part Number: 6983554P; RS Price/Stock: http://uk.rs-online.com/web/p/products/6983554P; Allied Price/Stock: https://www.alliedelec.com/avx-0805yc475kat2a/70474521/
C30 C43 C46-C58 C61 = GRM32CR72A105KA35L: Capacitor; Manufacturer_Name: Murata Electronics; Datasheet Link: https://componentsearchengine.com/Datasheets/1/GRM32CR72A105KA35L.pdf; Height: 1.8mm; Manufacturer_Part_Number: GRM32CR72A105KA35L; Mouser Part Number: 81-GRM32CR72A105KA35; Mouser Price/Stock: https://www.mouser.com/Search/Refine.aspx?Keyword=81-GRM32CR72A105KA35; RS Part Number: 8467366P; RS Price/Stock: http://uk.rs-online.com/web/p/products/8467366P
C33 = GRM32NR72A104KA01L: Capacitor; Manufacturer_Name: Murata Electronics; Datasheet Link: http://psearch.en.murata.com/capacitor/product/GRM32NR72A104KA01%23.pdf; Height: 1.5mm; Manufacturer_Part_Number: GRM32NR72A104KA01L; Mouser Part Number: 81-GRM422X104K100L; Mouser Price/Stock: https://www.mouser.com/Search/Refine.aspx?Keyword=81-GRM422X104K100L; RS Part Number: 8851985P; RS Price/Stock: http://uk.rs-online.com/web/p/products/8851985P
C36 = GRM31CR71H475KA12L: Capacitor; Manufacturer_Name: Murata Electronics; Datasheet Link: https://psearch.en.murata.com/capacitor/product/GRM31CR71H475KA12%23.html; Height: 1.8mm; Manufacturer_Part_Number: GRM31CR71H475KA12L; Mouser Part Number: 81-GRM31CR71H475KA2L; Mouser Price/Stock: https://www.mouser.com/Search/Refine.aspx?Keyword=81-GRM31CR71H475KA2L; RS Part Number: 7236580P; RS Price/Stock: http://uk.rs-online.com/web/p/products/7236580P
C39 C59 C62-C64 = C0603X104K3RACTU: Capacitor; Manufacturer_Name: Kemet; Datasheet Link: https://componentsearchengine.com/Datasheets/2/C0603X104K3RACTU.pdf; Height: 0.95mm; Manufacturer_Part_Number: C0603X104K3RACTU; Mouser Part Number: 80-C0603X104K3R; Mouser Price/Stock: https://www.mouser.com/Search/Refine.aspx?Keyword=80-C0603X104K3R; RS Part Number: 8691904; RS Price/Stock: http://uk.rs-online.com/web/p/products/8691904
C40 = GRM31CR72A105KA01L: Capacitor; Manufacturer_Name: Murata Electronics; Datasheet Link: http://www.murata.com/~/media/webrenewal/support/library/catalog/products/capacitor/mlcc/c02e.pdf; Height: 1.8mm; Manufacturer_Part_Number: GRM31CR72A105KA01L; Mouser Part Number: 81-GRM31CR72A105KA01; Mouser Price/Stock: https://www.mouser.com/Search/Refine.aspx?Keyword=81-GRM31CR72A105KA01; RS Part Number: 7236584P; RS Price/Stock: http://uk.rs-online.com/web/p/products/7236584P
C42 = C1608X7R1H223K080AA: Capacitor; Manufacturer_Name: TDK; Datasheet Link: https://product.tdk.com/info/en/catalog/datasheets/mlcc_commercial_midvoltage_en.pdf; Height: 0.8mm; Manufacturer_Part_Number: C1608X7R1H223K080AA; Mouser Part Number: 810-C1608X7R1H223K; Mouser Price/Stock: https://www.mouser.com/Search/Refine.aspx?Keyword=810-C1608X7R1H223K; RS Part Number: 7414453P; RS Price/Stock: http://uk.rs-online.com/web/p/products/7414453P
C45 C67 = GRM188R71C104KA01D: Capacitor; Manufacturer_Name: Murata Electronics; Datasheet Link: http://www.murata.com/~/media/webrenewal/support/library/catalog/products/capacitor/mlcc/c02e.pdf; Height: 0.9mm; Manufacturer_Part_Number: GRM188R71C104KA01D; Mouser Part Number: 81-GRM39X104K16; Mouser Price/Stock: https://www.mouser.com/Search/Refine.aspx?Keyword=81-GRM39X104K16; RS Part Number: 2207922; RS Price/Stock: http://uk.rs-online.com/web/p/products/2207922
C60 = C1210C185K3RACTU: Capacitor; Manufacturer_Name: Kemet; Datasheet Link: http://www.kemet.com/docfinder?Partnumber=C1210C185K3RACTU; Height: 1.7mm; Manufacturer_Part_Number: C1210C185K3RACTU; Mouser Part Number: 80-C1210C185K3R; Mouser Price/Stock: https://www.mouser.com/Search/Refine.aspx?Keyword=80-C1210C185K3R; RS Part Number: 8704781; RS Price/Stock: http://uk.rs-online.com/web/p/products/8704781
C67_2 = GRM188R72A104KA35D: Capacitor; Manufacturer_Name: Murata Electronics; Datasheet Link: http://www.murata.com/~/media/webrenewal/support/library/catalog/products/capacitor/mlcc/c02e.pdf; Height: 0.9mm; Manufacturer_Part_Number: GRM188R72A104KA35D; Mouser Part Number: 81-GRM188R72A104KA35; Mouser Price/Stock: https://www.mouser.com/Search/Refine.aspx?Keyword=81-GRM188R72A104KA35; RS Part Number: 7235742P; RS Price/Stock: http://uk.rs-online.com/web/p/products/7235742P
C68 = 08055A272JAT2A: Capacitor; Manufacturer_Name: AVX; Datasheet Link: https://componentsearchengine.com/Datasheets/1/08055A272JAT2A.pdf; Height: 1.47mm; Manufacturer_Part_Number: 08055A272JAT2A; Mouser Part Number: 581-08055A272JAT2A; Mouser Price/Stock: https://www.mouser.com/Search/Refine.aspx?Keyword=581-08055A272JAT2A
D1-D16 D22 = HSMG-C150: LED; Manufacturer_Name: Avago Technologies; Datasheet Link: http://docs-emea.rs-online.com/webdocs/04a6/0900766b804a6539.pdf; Height: 1.2mm; Manufacturer_Part_Number: HSMG-C150; Mouser Part Number: 630-HSMG-C150; Mouser Price/Stock: https://www.mouser.com/Search/Refine.aspx?Keyword=630-HSMG-C150; RS Part Number: 4860531P; RS Price/Stock: http://uk.rs-online.com/web/p/products/4860531P
D17 D18 D20 D21 = 1N4148W-7-F: Diode; Manufacturer_Name: Diodes Inc.; Allied_Number: 71028125; Datasheet Link: https://componentsearchengine.com/Datasheets/2/1N4148W-7-F.pdf; Height: 1.15mm; Manufacturer_Part_Number: 1N4148W-7-F; Mouser Part Number: 621-1N4148W-F; Mouser Price/Stock: https://www.mouser.com/Search/Refine.aspx?Keyword=621-1N4148W-F; RS Part Number: 7384728P; RS Price/Stock: http://uk.rs-online.com/web/p/products/7384728P; Allied Price/Stock: https://www.alliedelec.com/diodes-inc-1n4148w-7-f/71028125/
D19 = 1N5819HW-7-F: Diode; Manufacturer_Name: Diodes Inc.; Allied_Number: 70437201; Datasheet Link: http://www.diodes.com/_files/datasheets/ds30217.pdf; Height: 1.45mm; Manufacturer_Part_Number: 1N5819HW-7-F; Mouser Part Number: 621-1N5819HW-F; Mouser Price/Stock: https://www.mouser.com/Search/Refine.aspx?Keyword=621-1N5819HW-F; RS Part Number: 7082197P; RS Price/Stock: http://uk.rs-online.com/web/p/products/7082197P; Allied Price/Stock: http://www.alliedelec.com/diodes-inc-1n5819hw-7-f/70437201/
J1 = 70555-0056: Connector; Manufacturer_Name: Molex; Allied_Number: E5296708; Datasheet Link: http://www.molex.com/webdocs/datasheets/pdf/en-us//0705550056_PCB_HEADERS.pdf; Manufacturer_Part_Number: 70555-0056; Mouser Part Number: 538-70555-0056; Mouser Price/Stock: https://www.mouser.com/Search/Refine.aspx?Keyword=538-70555-0056; Allied Price/Stock: https://www.alliedelec.com/molex-incorporated-70555-0056/E5296708/
J2 = 43045-1601: Connector; Manufacturer_Name: Molex; Datasheet Link: https://www.molex.com/pdm_docs/sd/430451601_sd.pdf; Height: 9.02mm; Manufacturer_Part_Number: 43045-1601; Mouser Part Number: 538-43045-1601; Mouser Price/Stock: https://www.mouser.com/Search/Refine.aspx?Keyword=538-43045-1601; RS Part Number: 6700504P; RS Price/Stock: http://uk.rs-online.com/web/p/products/6700504P
J3 = 22-12-4062: Connector; Manufacturer_Name: Molex; Datasheet Link: http://www.molex.com/webdocs/datasheets/pdf/en-us//0022124062_PCB_HEADERS.pdf; Manufacturer_Part_Number: 22-12-4062; Mouser Part Number: 538-22-12-4062; Mouser Price/Stock: https://www.mouser.com/Search/Refine.aspx?Keyword=538-22-12-4062; RS Part Number: 6701254P; RS Price/Stock: http://uk.rs-online.com/web/p/products/6701254P
J4 J5 = 70551-0038: Connector; Manufacturer_Name: Molex; Allied_Number: 70967262; Datasheet Link: http://www.molex.com/pdm_docs/sd/705510038_sd.pdf; Manufacturer_Part_Number: 70551-0038; Mouser Part Number: 538-70551-0038; Mouser Price/Stock: https://www.mouser.com/Search/Refine.aspx?Keyword=538-70551-0038; Allied Price/Stock: https://www.alliedelec.com/molex-incorporated-70551-0038/70967262/
P1 = HTSW-107-07-G-D: Connector; Manufacturer_Name: SAMTEC; Datasheet Link: http://suddendocs.samtec.com/prints/htsw-xxx-xx-xxx-x-xx-xx-xx-mkt.pdf; Height: 6.73mm; Manufacturer_Part_Number: HTSW-107-07-G-D; Mouser Part Number: 200-HTSW10707GD; Mouser Price/Stock: https://www.mouser.com/Search/Refine.aspx?Keyword=200-HTSW10707GD; RS Part Number: 1801877; RS Price/Stock: https://uk.rs-online.com/web/p/products/1801877
Q1-Q16 = 2V7002KT1G: MOSFET (N-Channel); Manufacturer_Name: ON Semiconductor; Allied_Number: 70465745; Datasheet Link: http://www.onsemi.com/pub/Collateral/2N7002K-D.PDF; Height: 1.11mm; Manufacturer_Part_Number: 2V7002KT1G; Mouser Part Number: 863-2V7002KT1G; Mouser Price/Stock: https://www.mouser.com/Search/Refine.aspx?Keyword=863-2V7002KT1G; RS Part Number: 8009361P; RS Price/Stock: http://uk.rs-online.com/web/p/products/8009361P; Allied Price/Stock: http://www.alliedelec.com/on-semiconductor-2v7002kt1g/70465745/
Q17 = ZXTN4004KTC: Transistor; Manufacturer_Name: Diodes Inc.; Allied_Number: 70438940; Datasheet Link: http://www.diodes.com/_files/datasheets/ZXTN4004K.pdf; Height: 2.39mm; Manufacturer_Part_Number: ZXTN4004KTC; Mouser Part Number: 621-ZXTN4004KTC; Mouser Price/Stock: https://www.mouser.com/Search/Refine.aspx?Keyword=621-ZXTN4004KTC; RS Part Number: 7705222P; RS Price/Stock: http://uk.rs-online.com/web/p/products/7705222P; Allied Price/Stock: http://www.alliedelec.com/diodes-inc-zxtn4004ktc/70438940/
Q18 = SI2319DS-T1-E3: Integrated Circuit; Manufacturer_Name: Vishay; Allied_Number: 70026411; Datasheet Link: http://www.vishay.com/docs/72315/72315.pdf; Height: 1.12mm; Manufacturer_Part_Number: SI2319DS-T1-E3; Mouser Part Number: 781-SI2319DS-T1-E3; Mouser Price/Stock: https://www.mouser.com/Search/Refine.aspx?Keyword=781-SI2319DS-T1-E3; RS Part Number: 7104689P; RS Price/Stock: http://uk.rs-online.com/web/p/products/7104689P; Allied Price/Stock: http://www.alliedelec.com/siliconix-vishay-si2319ds-t1-e3/70026411/
Q19 = 2N7002E-T1-E3: Integrated Circuit; Manufacturer_Name: Vishay; Allied_Number: 70459644; Datasheet Link: http://www.vishay.com/docs/70860/70860.pdf; Height: 1.12mm; Manufacturer_Part_Number: 2N7002E-T1-E3; Mouser Part Number: 781-2N7002E-T1-E3; Mouser Price/Stock: https://www.mouser.com/Search/Refine.aspx?Keyword=781-2N7002E-T1-E3; Allied Price/Stock: http://www.alliedelec.com/siliconix-vishay-2n7002e-t1-e3/70459644/
R1-R16 = CRCW251275R0FKEG: Resistor; Manufacturer_Name: Vishay; Allied_Number: 70204613; Datasheet Link: http://www.vishay.com/docs/20035/dcrcwe3.pdf; Height: 0.7mm; Manufacturer_Part_Number: CRCW251275R0FKEG; Mouser Part Number: 71-CRCW2512-75-E3; Mouser Price/Stock: https://www.mouser.com/Search/Refine.aspx?Keyword=71-CRCW2512-75-E3; RS Part Number: 8429623; RS Price/Stock: http://uk.rs-online.com/web/p/products/8429623; Allied Price/Stock: https://www.alliedelec.com/vishay-dale-crcw251275r0fkeg/70204613/
R17 R50 R53 R56 R63 R66 R68 R70 R72 = CRCW060310K0FKEA: Resistor; Manufacturer_Name: Vishay; Allied_Number: 70201153; Datasheet Link: http://www.vishay.com/docs/20035/dcrcwe3.pdf; Height: 0.5mm; Manufacturer_Part_Number: CRCW060310K0FKEA; Mouser Part Number: 71-CRCW0603-10K-E3; Mouser Price/Stock: https://www.mouser.com/Search/Refine.aspx?Keyword=71-CRCW0603-10K-E3; RS Part Number: 6789667P; RS Price/Stock: http://uk.rs-online.com/web/p/products/6789667P; Allied Price/Stock: https://www.alliedelec.com/vishay-dale-crcw060310k0fkea/70201153/
R18 R21-R24 R77 R82 R85 R90 R93 R98 R101 R106 R109 R114 R117 R122 R125 R130 R133 R137 = RC0603FR-07100KL: Resistor; Manufacturer_Name: YAGEO (PHYCOMP); Datasheet Link: http://www.yageo.com/documents/recent/PYu-RC0603_51_RoHS_L_v5.pdf; Height: 0.55mm; Manufacturer_Part_Number: RC0603FR-07100KL; Mouser Part Number: 603-RC0603FR-07100KL; Mouser Price/Stock: https://www.mouser.com/Search/Refine.aspx?Keyword=603-RC0603FR-07100KL; RS Part Number: 5048940; RS Price/Stock: http://uk.rs-online.com/web/p/products/5048940
R19 = RC0603FR-0749K9L: Resistor; Manufacturer_Name: YAGEO (PHYCOMP); Datasheet Link: http://www.yageo.com/documents/recent/PYu-RC0603_51_RoHS_L_v5.pdf; Height: 0.55mm; Manufacturer_Part_Number: RC0603FR-0749K9L; Mouser Part Number: 603-RC0603FR-0749K9L; Mouser Price/Stock: https://www.mouser.com/Search/Refine.aspx?Keyword=603-RC0603FR-0749K9L; RS Part Number: 5047537; RS Price/Stock: http://uk.rs-online.com/web/p/products/5047537
R20 = CRCW1206100RFKEA: Resistor; Manufacturer_Name: Vishay; Allied_Number: 70204246; Datasheet Link: http://www.vishay.com/docs/20035/dcrcwe3.pdf; Height: 0.6mm; Manufacturer_Part_Number: CRCW1206100RFKEA; Mouser Part Number: 71-CRCW1206-100-E3; Mouser Price/Stock: https://www.mouser.com/Search/Refine.aspx?Keyword=71-CRCW1206-100-E3; Allied Price/Stock: http://www.alliedelec.com/vishay-dale-crcw1206100rfkea/70204246/
R25-R32 = CRCW120610R0FKEA: Resistor; Manufacturer_Name: Vishay; Allied_Number: 70204206; Datasheet Link: http://www.vishay.com/docs/20035/dcrcwe3.pdf; Height: 0.6mm; Manufacturer_Part_Number: CRCW120610R0FKEA; Mouser Part Number: 71-CRCW1206-10-E3; Mouser Price/Stock: https://www.mouser.com/Search/Refine.aspx?Keyword=71-CRCW1206-10-E3; RS Part Number: 6791774P; RS Price/Stock: http://uk.rs-online.com/web/p/products/6791774P; Allied Price/Stock: https://www.alliedelec.com/vishay-dale-crcw120610r0fkea/70204206/
R33 R35-R37 = CRCW060349R9FKEA: Resistor; Manufacturer_Name: Vishay; Allied_Number: 70202967; Datasheet Link: http://www.vishay.com/docs/20035/dcrcwe3.pdf; Height: 0.5mm; Manufacturer_Part_Number: CRCW060349R9FKEA; Mouser Part Number: 71-CRCW0603-49.9-E3; Mouser Price/Stock: https://www.mouser.com/Search/Refine.aspx?Keyword=71-CRCW0603-49.9-E3; RS Part Number: 6790459P; RS Price/Stock: http://uk.rs-online.com/web/p/products/6790459P; Allied Price/Stock: https://www.alliedelec.com/vishay-dale-crcw060349r9fkea/70202967/
R34 = CRCW0603100RFKEA: Resistor; Manufacturer_Name: Vishay; Allied_Number: 70202995; Datasheet Link: http://www.vishay.com/docs/20035/dcrcwe3.pdf; Height: 0.5mm; Manufacturer_Part_Number: CRCW0603100RFKEA; Mouser Part Number: 71-CRCW0603-100-E3; Mouser Price/Stock: https://www.mouser.com/Search/Refine.aspx?Keyword=71-CRCW0603-100-E3; RS Part Number: 2509682456; RS Price/Stock: http://uk.rs-online.com/web/p/products/2509682456; Allied Price/Stock: https://www.alliedelec.com/vishay-dale-crcw0603100rfkea/70202995/
R51 R55 R58 R65 R67 R69 R71 R73 = CRCW060310R0FKEA: Resistor; Manufacturer_Name: Vishay; Allied_Number: 70201157; Datasheet Link: http://www.vishay.com/docs/20035/dcrcwe3.pdf; Height: 0.5mm; Manufacturer_Part_Number: CRCW060310R0FKEA; Mouser Part Number: 71-CRCW0603-10-E3; Mouser Price/Stock: https://www.mouser.com/Search/Refine.aspx?Keyword=71-CRCW0603-10-E3; RS Part Number: 6789695P; RS Price/Stock: http://uk.rs-online.com/web/p/products/6789695P; Allied Price/Stock: http://www.alliedelec.com/vishay-dale-crcw060310r0fkea/70201157/
R52 R54 = CRCW2512200RJNEG: Resistor; Manufacturer_Name: Vishay; Allied_Number: 70204627; Datasheet Link: http://www.vishay.com/docs/20035/dcrcwe3.pdf; Height: 0.7mm; Manufacturer_Part_Number: CRCW2512200RJNEG; Mouser Part Number: 71-CRCW2512J-200-E3; Mouser Price/Stock: https://www.mouser.com/Search/Refine.aspx?Keyword=71-CRCW2512J-200-E3; RS Part Number: 8429493; RS Price/Stock: http://uk.rs-online.com/web/p/products/8429493; Allied Price/Stock: https://www.alliedelec.com/vishay-dale-crcw2512200rjneg/70204627/
R57 R59 = CRCW06030000Z0EA: Resistor; Manufacturer_Name: Vishay; Allied_Number: 70202889; Datasheet Link: http://www.vishay.com/docs/20035/dcrcwe3.pdf; Height: 0.5mm; Manufacturer_Part_Number: CRCW06030000Z0EA; Mouser Part Number: 71-CRCW0603-0-E3; Mouser Price/Stock: https://www.mouser.com/Search/Refine.aspx?Keyword=71-CRCW0603-0-E3; RS Part Number: 2508364822; RS Price/Stock: http://uk.rs-online.com/web/p/products/2508364822; Allied Price/Stock: https://www.alliedelec.com/vishay-dale-crcw06030000z0ea/70202889/
R60 R76 R81 R83 R89 R91 R97 R99 R105 R107 R113 R115 R121 R123 R129 R131 R136 = CRCW06032K00FKEA: Resistor; Manufacturer_Name: Vishay; Allied_Number: 70203180; Datasheet Link: http://www.vishay.com/docs/20035/dcrcwe3.pdf; Height: 0.5mm; Manufacturer_Part_Number: CRCW06032K00FKEA; Mouser Part Number: 71-CRCW0603-2.0K-E3; Mouser Price/Stock: https://www.mouser.com/Search/Refine.aspx?Keyword=71-CRCW0603-2.0K-E3; RS Part Number: 2508364901; RS Price/Stock: http://uk.rs-online.com/web/p/products/2508364901; Allied Price/Stock: https://www.alliedelec.com/vishay-dale-crcw06032k00fkea/70203180/
R61 R62 = RC0603FR-071RL: Resistor; Manufacturer_Name: YAGEO (PHYCOMP); Datasheet Link: http://www.yageo.com/documents/recent/PYu-RC0603_51_RoHS_L_v5.pdf; Height: 0.55mm; Manufacturer_Part_Number: RC0603FR-071RL; Mouser Part Number: 603-RC0603FR-071RL; Mouser Price/Stock: https://www.mouser.com/Search/Refine.aspx?Keyword=603-RC0603FR-071RL; RS Part Number: 5048978; RS Price/Stock: http://uk.rs-online.com/web/p/products/5048978
R64 = ERJ-3RQFR39V: Resistor; Manufacturer_Name: Panasonic; Datasheet Link: http://componentsearchengine.com/Datasheets/1/ERJ-3RQFR39V.pdf; Manufacturer_Part_Number: ERJ-3RQFR39V; Mouser Part Number: 667-ERJ-3RQFR39V; Mouser Price/Stock: https://www.mouser.com/Search/Refine.aspx?Keyword=667-ERJ-3RQFR39V
R74 R75 R78-R80 R84 R86-R88 R92 R94-R96 R100 R102-R104 R108 R110-R112 R116 R118-R120 R124 R126-R128 R132 R134 R135 R138 = CRCW06031K00FKEA: Resistor; Manufacturer_Name: Vishay; Allied_Number: 70203133; Datasheet Link: http://www.vishay.com/docs/20035/dcrcwe3.pdf; Height: 0.5mm; Manufacturer_Part_Number: CRCW06031K00FKEA; Mouser Part Number: 71-CRCW0603-1.0K-E3; Mouser Price/Stock: https://www.mouser.com/Search/Refine.aspx?Keyword=71-CRCW0603-1.0K-E3; RS Part Number: 6789875P; RS Price/Stock: http://uk.rs-online.com/web/p/products/6789875P; Allied Price/Stock: https://www.alliedelec.com/vishay-dale-crcw06031k00fkea/70203133/
SW2 = 204-221ST: Switch; Manufacturer_Name: CTS; Datasheet Link: http://www.mouser.com/ds/2/96/cts electronic components_204-543458.pdf; Manufacturer_Part_Number: 204-221ST; Mouser Part Number: 774-204221ST; Mouser Price/Stock: https://www.mouser.com/Search/Refine.aspx?Keyword=774-204221ST
T1-T4 = 744242471: Inductor; Manufacturer_Name: Wurth Elektronik; Datasheet Link: http://katalog.we-online.com/pbs/datasheet/744242471.pdf; Height: 3mm; Manufacturer_Part_Number: 744242471; Mouser Part Number: 710-744242471; Mouser Price/Stock: https://www.mouser.com/Search/Refine.aspx?Keyword=710-744242471; RS Part Number: 9040274P; RS Price/Stock: http://uk.rs-online.com/web/p/products/9040274P
T5-T8 = ACT45B-101-2P-TL003: Filter; Manufacturer_Name: TDK; Datasheet Link: https://product.tdk.com/info/en/catalog/datasheets/cmf_automotive_signal_act45b_en.pdf; Manufacturer_Part_Number: ACT45B-101-2P-TL003; Mouser Part Number: 810-ACT45B1012PTL003; Mouser Price/Stock: https://www.mouser.com/Search/Refine.aspx?Keyword=810-ACT45B1012PTL003
U1 = BQ76PL455ATPFCRQ1: Integrated Circuit; Manufacturer_Name: Texas Instruments; Datasheet Link: http://www.ti.com/lit/gpn/bq76pl455a-q1; Height: 1.2mm; Manufacturer_Part_Number: BQ76PL455ATPFCRQ1; Mouser Part Number: 595-Q76PL455ATPFCRQ1; Mouser Price/Stock: https://www.mouser.com/Search/Refine.aspx?Keyword=595-Q76PL455ATPFCRQ1
U2 = NC7SZ04M5X: Integrated Circuit; Manufacturer_Name: ON Semiconductor; Datasheet Link: http://uk.rs-online.com/web/p/products/6709797; Height: 1.45mm; Manufacturer_Part_Number: NC7SZ04M5X; Mouser Part Number: 512-NC7SZ04M5X; Mouser Price/Stock: https://www.mouser.com/Search/Refine.aspx?Keyword=512-NC7SZ04M5X; RS Part Number: 6709797P; RS Price/Stock: http://uk.rs-online.com/web/p/products/6709797P
Z1-Z16 = DDZ6V2B-7: Zener Diode; Manufacturer_Name: Diodes Inc.; Allied_Number: 70551182; Datasheet Link: http://uk.rs-online.com/web/p/products/8222365; Height: 1.45mm; Manufacturer_Part_Number: DDZ6V2B-7; Mouser Part Number: 621-DDZ6V2B-7; Mouser Price/Stock: https://www.mouser.com/Search/Refine.aspx?Keyword=621-DDZ6V2B-7; RS Part Number: 8222365P; RS Price/Stock: http://uk.rs-online.com/web/p/products/8222365P; Allied Price/Stock: https://www.alliedelec.com/diodes-inc-ddz6v2b-7/70551182/
Z19 = SMAJ90A: Diode; Manufacturer_Name: LITTELFUSE; Datasheet Link: http://www.littelfuse.com/~/media/electronics/datasheets/tvs_diodes/littelfuse_tvs_diode_smaj_datasheet.pdf.pdf; Height: 2.29mm; Manufacturer_Part_Number: SMAJ90A; Mouser Part Number: 576-SMAJ90A; Mouser Price/Stock: https://www.mouser.com/Search/Refine.aspx?Keyword=576-SMAJ90A
Z20-Z27 = PESD5V0U1UA,115: Diode; Manufacturer_Name: Nexperia; Datasheet Link: https://componentsearchengine.com/Datasheets/1/PESD5V0U1UA,115.pdf; Height: 1.1mm; Manufacturer_Part_Number: PESD5V0U1UA,115; Mouser Part Number: 771-PESD5V0U1UA-T/R; Mouser Price/Stock: https://www.mouser.com/Search/Refine.aspx?Keyword=771-PESD5V0U1UA-T%2FR; RS Part Number: 8166751P; RS Price/Stock: http://uk.rs-online.com/web/p/products/8166751P